# EAGLE design FabScan-Shield_v11 (EAGLE 7.5.0)
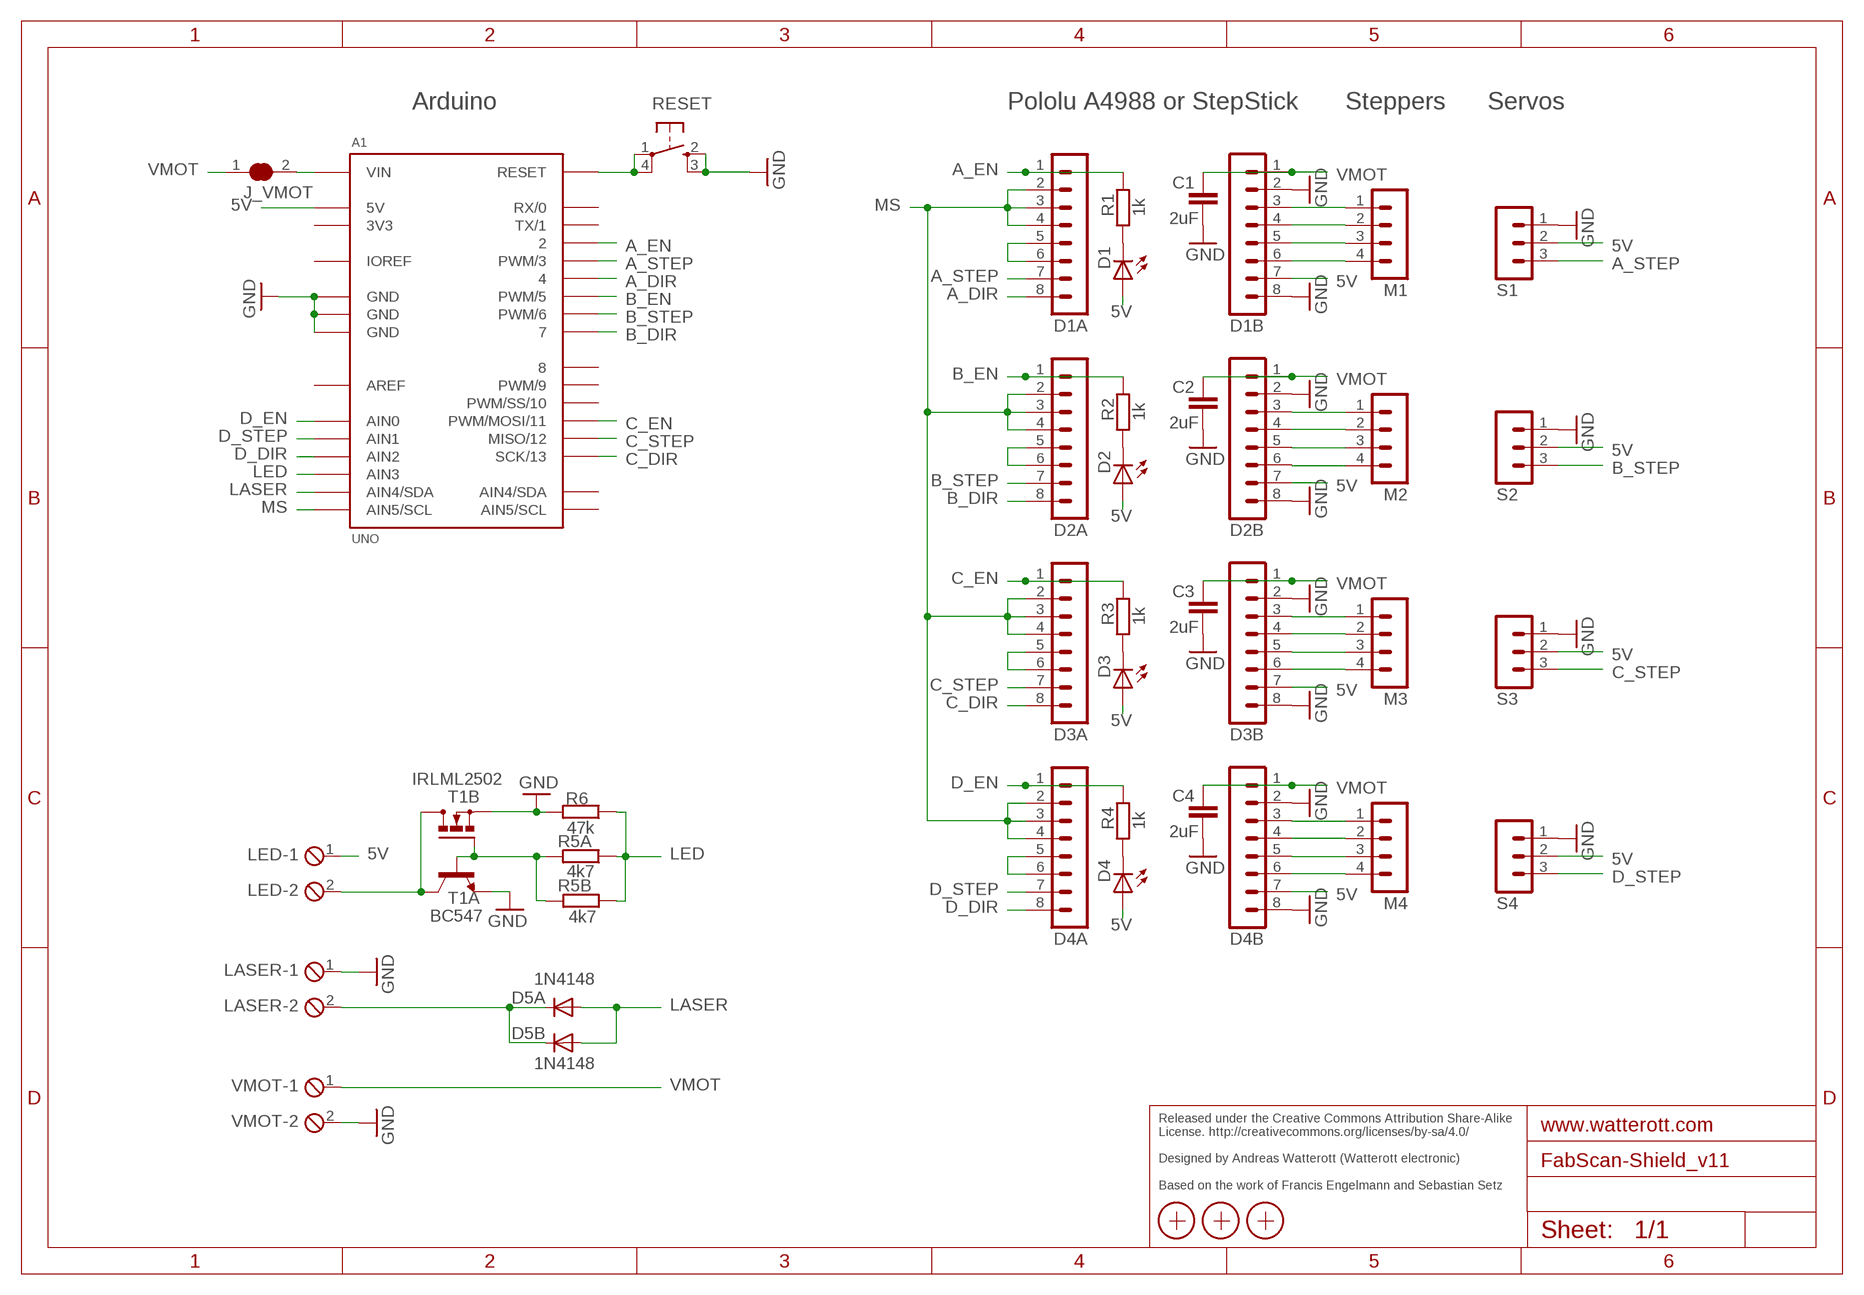
[diagram p0: schematic, sheet 1]

## Parts
A1  UNO  [UNO]
C1  2uF  C-EUC0603  [C0603]
C2  2uF  C-EUC0603  [C0603]
C3  2uF  C-EUC0603  [C0603]
C4  2uF  C-EUC0603  [C0603]
D1  LEDCHIPLED_0603  [CHIPLED_0603]
D1A  MA08-1  [MA08-1]
D1B  MA08-1  [MA08-1]
D2  LEDCHIPLED_0603  [CHIPLED_0603]
D2A  MA08-1  [MA08-1]
D2B  MA08-1  [MA08-1]
D3  LEDCHIPLED_0603  [CHIPLED_0603]
D3A  MA08-1  [MA08-1]
D3B  MA08-1  [MA08-1]
D4  LEDCHIPLED_0603  [CHIPLED_0603]
D4A  MA08-1  [MA08-1]
D4B  MA08-1  [MA08-1]
D5A  1N4148  1N4148DO35-7  [DO35-7]
D5B  1N4148  DIODE-SOD106-R  [SOD106-R]
J_VMOT  SJ  [SJ]
LASER  MPT2  [2POL254]
LED  MPT2  [2POL254]
M1  MA04-1  [MA04-1]
M2  MA04-1  [MA04-1]
M3  MA04-1  [MA04-1]
M4  MA04-1  [MA04-1]
R1  1k  R-EU_R0603  [R0603]
R2  1k  R-EU_R0603  [R0603]
R3  1k  R-EU_R0603  [R0603]
R4  1k  R-EU_R0603  [R0603]
R5A  4k7  R-EU_0204/7  [0204/7]
R5B  4k7  R-EU_R0603  [R0603]
R6  47k  R-EU_R0603  [R0603]
RESET  SW_SMDS  [SW_SMD4]
S1  MA03-1  [MA03-1]
S2  MA03-1  [MA03-1]
S3  MA03-1  [MA03-1]
S4  MA03-1  [MA03-1]
T1A  BC547  [TO92]
T1B  IRLML2502  [MICRO3]
VMOT  MPT2  [2POL254]
X1  PASSER  [PASSER]
X2  PASSER  [PASSER]
X3  PASSER  [PASSER]

## Nets
5V: A1.5V D1.A D1B.7 D2.A D2B.7 D3.A D3B.7 D4.A D4B.7 LED.1 S1.2 S2.2 S3.2 S4.2
A_1A: D1B.5 M1.3
A_1B: D1B.6 M1.4
A_2A: D1B.4 M1.2
A_2B: D1B.3 M1.1
A_DIR: A1.4 D1A.8
A_EN: A1.2 D1A.1 R1.1
A_RST: D1A.5 D1A.6
A_STEP: A1.3(PWM/3) D1A.7 S1.3
B_1A: D2B.5 M2.3
B_1B: D2B.6 M2.4
B_2A: D2B.4 M2.2
B_2B: D2B.3 M2.1
B_DIR: A1.7 D2A.8
B_EN: A1.5(PWM/5) D2A.1 R2.1
B_STEP: A1.6(PWM/6) D2A.7 S2.3
C_1A: D3B.5 M3.3
C_1B: D3B.6 M3.4
C_2A: D3B.4 M3.2
C_2B: D3B.3 M3.1
C_DIR: A1.13(SCK/13) D3A.8
C_EN: A1.11(PWM/MOSI/11) D3A.1 R3.1
C_STEP: A1.12(MISO/12) D3A.7 S3.3
D_1A: D4B.5 M4.3
D_1B: D4B.6 M4.4
D_2A: D4B.4 M4.2
D_2B: D4B.3 M4.1
D_DIR: A1.AIN2 D4A.8
D_EN: A1.AIN0 D4A.1 R4.1
D_STEP: A1.AIN1 D4A.7 S4.3
GND: A1.GND@1(GND) A1.GND@2(GND) A1.GND@3(GND) C1.2 C2.2 C3.2 C4.2 D1B.2 D1B.8 D2B.2 D2B.8 D3B.2 D3B.8 D4B.2 D4B.8 LASER.1 R6.2 RESET.2(S) RESET.3(S1) S1.1 S2.1 S3.1 S4.1 T1A.1(E) T1B.2(S) VMOT.2
LASER: A1.AIN4(AIN4/SDA) D5A.A D5B.A
LED: A1.AIN3 R5A.1 R5B.2 R6.1
MS: A1.AIN5(AIN5/SCL) D1A.2 D1A.3 D1A.4 D2A.2 D2A.3 D2A.4 D3A.2 D3A.3 D3A.4 D4A.2 D4A.3 D4A.4
N$1: D5A.C D5B.C LASER.2
N$2: D1.C R1.2
N$3: D2.C R2.2
N$4: D3.C R3.2
N$5: D4A.5 D4A.6
N$6: LED.2 T1A.3(C) T1B.3(D)
N$7: D4.C R4.2
N$8: R5A.2 R5B.1 T1A.2(B) T1B.1(G)
N$20: D2A.5 D2A.6
N$28: D3A.5 D3A.6
RST: A1.RST(RESET) RESET.1(P) RESET.4(P1)
VIN: A1.VIN J_VMOT.2
VMOT: C1.1 C2.1 C3.1 C4.1 D1B.1 D2B.1 D3B.1 D4B.1 J_VMOT.1 VMOT.1
Unconnected: A1.0(RX/0) A1.1(TX/1) A1.8 A1.9(PWM/9) A1.10(PWM/SS/10) A1.SCL(AIN5/SCL) A1.SDA(AIN4/SDA)

## Notes on the sheet
- Arduino | Pololu A4988 or StepStick | Steppers | Servos
- Released under the Creative Commons Attribution Share-Alike 
  License. http://creativecommons.org/licenses/by-sa/4.0/
  
  Designed by Andreas Watterott (Watterott electronic)
  
  Based on the work of Francis Engelmann and Sebastian Setz

## Power pins joined to a net without a drawn wire
3V3: A1.3V3
AREF: A1.AREF
IOREF: A1.IOREF

## Library data of the parts
A1 = Arduino:UNO
C1-C4 = rcl:C-EU: CAPACITOR, European symbol
D1-D4 = led:LED: LED OSRAM: - CHIPLED LG R971, LG N971, LY N971, LG Q971, LY Q971, LO R971, LY R971 LH N974, LH R974 LS Q976, LO Q976, LY Q976 LO Q996 - Hyper CHIPLED LW Q18S LB Q993, LB Q99A, LB R99A - SideLED LS A670, LO A670, LY A670, LG A670, LP A670 LB A673, LV A673, LT A673, LW A673 LH A674 LY A675 LS A676, LA A676, LO A676, LY A676, LW A676 LS A679, LY A679, LG A679 - Hyper Micro SIDELED® LS Y876, LA Y876, LO Y876, LY Y876 LT Y87S - SmartLED LW L88C, LW L88S LB L89C, LB L89S, LG L890 LS L89K, LO L89K, LY L89K LS L896, LA L896, LO L896, LY L896 - TOPLED LS T670, LO T670, LY T670, LG T670, LP T670 LSG T670, LSP T670, LSY T670, LOP T670, LYG T670 LG T671, LOG T671, LSG T671 LB T673, LV T673, LT T673, LW T673 LH T674 LS T676, LA T676, LO T676, LY T676, LB T676, LH T676, LSB T676, LW T676 LB T67C, LV T67C, LT T67C, LS T67K, LO T67K, LY T67K, LW E67C LS E67B, LA E67B, LO E67B, LY E67B, LB E67C, LV E67C, LT E67C LW T67C LS T679, LY T679, LG T679 LS T770, LO T770, LY T770, LG T770, LP T770 LB T773, LV T773, LT T773, LW T773 LH T774 LS E675, LA E675, LY E675, LS T675 LS T776, LA T776, LO T776, LY T776, LB T776 LHGB T686 LT T68C, LB T68C - Hyper Mini TOPLED® LB M676 - Mini TOPLED Santana® LG M470 LS M47K, LO M47K, LY M47K Source: http://www.osram.convergy.de LUXEON: - LUMILED® LXK2-PW12-R00, LXK2-PW12-S00, LXK2-PW14-U00, LXK2-PW14-V00 LXK2-PM12-R00, LXK2-PM12-S00, LXK2-PM14-U00 LXK2-PE12-Q00, LXK2-PE12-R00, LXK2-PE12-S00, LXK2-PE14-T00, LXK2-PE14-U00 LXK2-PB12-K00, LXK2-PB12-L00, LXK2-PB12-M00, LXK2-PB14-N00, LXK2-PB14-P00, LXK2-PB14-Q00 LXK2-PR12-L00, LXK2-PR12-M00, LXK2-PR14-Q00, LXK2-PR14-R00 LXK2-PD12-Q00, LXK2-PD12-R00, LXK2-PD12-S00 LXK2-PH12-R00, LXK2-PH12-S00 LXK2-PL12-P00, LXK2-PL12-Q00, LXK2-PL12-R00 Source: www.luxeon.com KINGBRIGHT: KA-3528ASYC Source: www.kingbright.com
D1A D1B D2A D2B D3A D3B D4A D4B = con-lstb:MA08-1: PIN HEADER; OC_FARNELL: unknown; OC_NEWARK: unknown
D5A = diode:1N4148: DIODE high speed (Philips)
D5B = diode:DIODE-: DIODE
J_VMOT = jumper:SJ: SMD solder JUMPER
LASER LED VMOT = con-phoenix-254:MPT2: PHOENIX CONNECTOR; OC_FARNELL: unknown; OC_NEWARK: unknown
M1-M4 = con-lstb:MA04-1: PIN HEADER; OC_FARNELL: unknown; OC_NEWARK: unknown
R1-R4 R5A R5B R6 = rcl:R-EU_: RESISTOR, European symbol
RESET = Switch-SMD:SW_SMD
S1-S4 = con-lstb:MA03-1: PIN HEADER; OC_FARNELL: unknown; OC_NEWARK: unknown
T1A = transistor:BC547: NPN TRANSISTOR
T1B = IRF-sot23:IRLML2502: N-Channel Power MOSFET
X1-X3 = SMD:PASSER

## Board
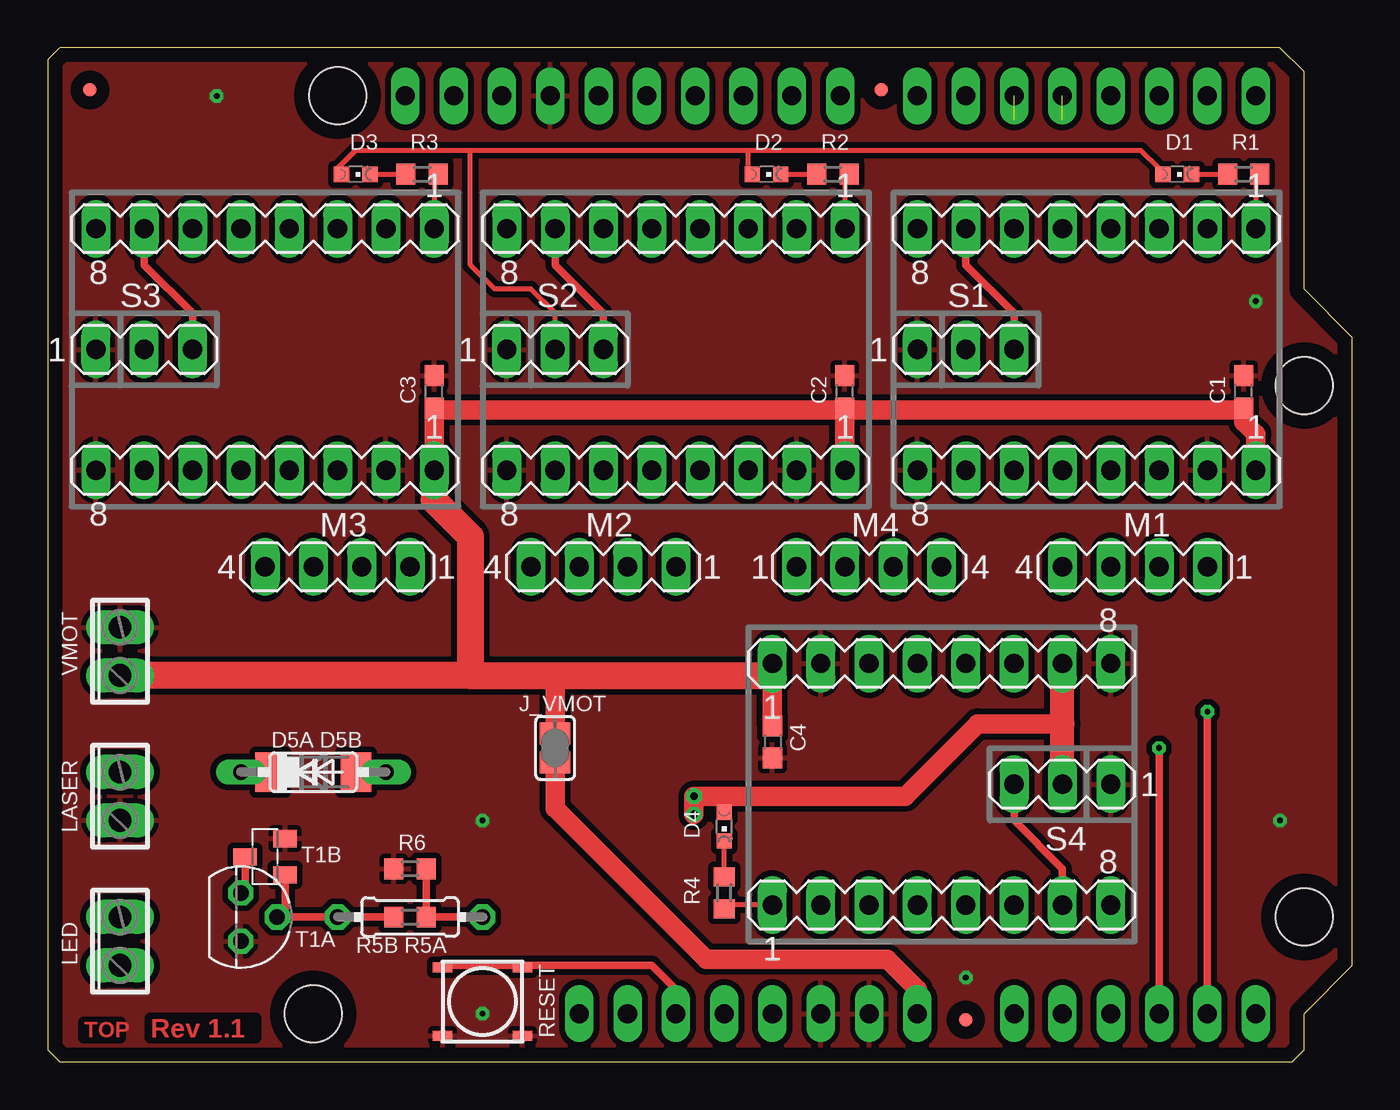
[diagram p1: board, top side]
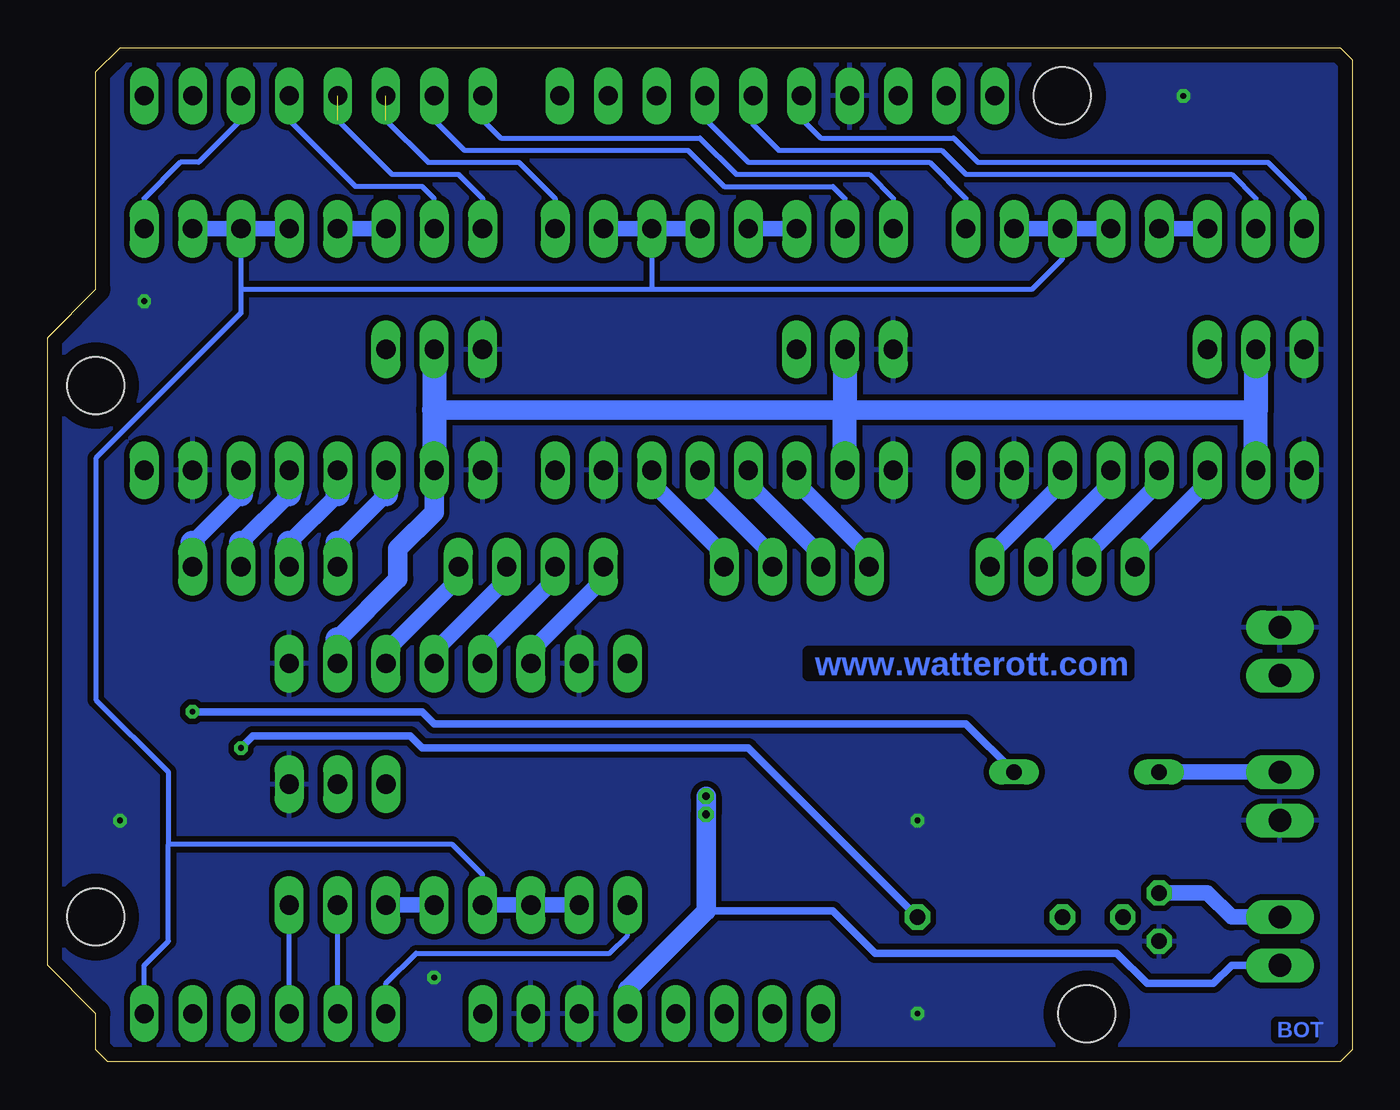
[diagram p2: board, bottom side, seen from below]

Size 68.58 x 53.34 mm. Coordinates in mm from the lower left corner, seen from the top.
Copper layers (1*16): Top 0.035mm / dielectric 1.5mm / Bottom 0.035mm
Design rules "default *": minimum track width 8mil, minimum drill 0.3mm, track to track 8mil, track to pad 8mil, pad to pad 8mil, via to via 8mil, smd to smd 8mil, copper to edge 30mil, drill to drill 8mil, minimum pad ring 10mil, minimum via ring 8mil, stop-mask expansion 4mil, vias tented up to drill 0.5mm, thermal gap 10mil

### Footprints (pad centres in the part's own frame; a part is rotated, then mirrored left to right if it is on the bottom)
UNO = drill 1 long: 0 63.5,50.8; 1 60.96,50.8; 2 58.42,50.8; 3 55.88,50.8; 3V3 35.56,2.54; 4 53.34,50.8; 5 50.8,50.8; 5V 38.1,2.54; 6 48.26,50.8; 7 45.72,50.8; 8 41.656,50.8; 9 39.116,50.8; 10 36.576,50.8; 11 34.036,50.8; 12 31.496,50.8; 13 28.956,50.8; AIN0 50.8,2.54; AIN1 53.34,2.54; AIN2 55.88,2.54; AIN3 58.42,2.54; AIN4 60.96,2.54; AIN5 63.5,2.54; AREF 23.876,50.8; GND@1 40.64,2.54; GND@2 43.18,2.54; GND@3 26.416,50.8; IOREF 30.48,2.54; NC 27.94,2.54; RST 33.02,2.54; SCL 18.796,50.8; SDA 21.336,50.8; VIN 45.72,2.54 | hole 3: 66.04,35.56; 66.04,7.62; 15.24,50.8; 13.97,2.54
C0603 = smd 1.1 x 1: 1 -0.85,0; 2 0.85,0
CHIPLED_0603 = smd 0.8 x 0.8: A 0,-0.75; C 0,0.75
MA08-1 = drill 1.016 long: 1 -8.89,0; 2 -6.35,0; 3 -3.81,0; 4 -1.27,0; 5 1.27,0; 6 3.81,0; 7 6.35,0; 8 8.89,0
DO35-7 = drill 0.813 long: A 3.81,0; C -3.81,0
SOD106-R = smd 1.6 x 2.1: A 2.25,0; C -2.25,0
SJ = smd 1.168 x 1.6: 1 -0.762,0; 2 0.762,0
2POL254 = drill 1.2 long: 1 -1.27,0; 2 1.27,0
MA04-1 = drill 1.016 long: 1 -3.81,0; 2 -1.27,0; 3 1.27,0; 4 3.81,0
R0603 = smd 1 x 1.1: 1 -0.85,0; 2 0.85,0
0204/7 = drill 0.813 octagon: 1 -3.81,0; 2 3.81,0
SW_SMD4 = smd 0.508 x 1.016: 1 -1.8,-2.1; 2 1.8,-2.1; 3 1.8,2.1; 4 -1.8,2.1
MA03-1 = drill 1.016 long: 1 -2.54,0; 2 0,0; 3 2.54,0
TO92 = drill 0.813 octagon: 1 1.27,0; 2 0,1.905; 3 -1.27,0
MICRO3 = smd 0.9 x 1.25: 1 -0.95,-1.05; 2 0.95,-1.05; 3 0,1.05
PASSER = smd 0.7 x 0.7: X 0,0

### Placement (x,y rotation side)
A1  0,0 0 top
C1  62.87,35.24 90 top
C2  41.91,35.24 90 top
C3  20.32,35.24 90 top
C4  38.1,16.83 270 top
D1  59.37,46.67 270 top
D1A  54.61,43.81 180 top
D1B  54.61,31.11 180 top
D2  37.78,46.67 270 top
D2A  33.02,43.81 180 top
D2B  33.02,31.11 180 top
D3  16.19,46.67 270 top
D3A  11.43,43.81 180 top
D3B  11.43,31.11 180 top
D4  35.56,12.38 180 top
D4A  46.99,8.26 0 top
D4B  46.99,20.95 0 top
D5A  13.97,15.24 0 top
D5B  13.97,15.24 0 top
J_VMOT  26.67,16.51 270 top
LASER  3.81,13.97 90 top
LED  3.81,6.35 90 top
M1  57.15,26.04 180 top
M2  29.21,26.04 180 top
M3  15.24,26.04 180 top
M4  43.18,26.04 0 top
R1  62.87,46.67 180 top
R2  41.27,46.67 180 top
R3  19.68,46.67 180 top
R4  35.56,8.89 90 top
R5A  19.05,7.62 180 top
R5B  19.05,7.62 0 top
R6  19.05,10.16 180 top
RESET  22.86,3.17 270 top
S1  48.26,37.47 0 top
S2  26.67,37.47 0 top
S3  5.08,37.47 0 top
S4  53.34,14.61 180 top
T1A  10.16,7.62 270 top
T1B  11.43,10.79 90 top
VMOT  3.81,21.59 90 top
X1  2.22,51.12 0 top
X2  48.26,2.22 0 top
X3  43.81,51.12 0 top

### Tracks (layer width: path | path; a pad name or v marks a point on that pad's centre or on a via)
5V  (via drill 0.4)
  Top 0.254: D3.A 15.24,46.67 15.24,46.99 16.19,47.94 22.23,47.94 | 22.23,47.94 36.83,47.94 | 36.83,47.94 57.47,47.94 58.42,46.99 58.42,46.88 D1.A | D2.A 36.83,46.67 36.83,47.94 | S2.2 26.67,39.37 25.4,40.64 23.5,40.64 22.23,41.91 22.23,47.94 | D4.A 35.56,13.65 35.88,13.97
  Top 1.016: 53.34,17.78 48.9,17.78 45.09,13.97 35.88,13.97 v33.97,13.97 v33.97,13.02
  Top 1.27: S4.2 53.34,17.78 D4B.7
  Bottom 0.406: LED.1 6.35,5.08 7.3,4.13 10.79,4.13 12.38,5.71 25.08,5.71 27.3,7.94 33.97,7.94
  Bottom 1.016: 5.08,34.29 26.67,34.29 48.26,34.29 | A1.5V 38.1,3.81 33.97,7.94 v33.97,13.02 v33.97,13.97 | 53.34,22.23 50.16,25.4 50.16,26.99 48.26,28.89 D1B.7
  Bottom 1.27: D3B.7 5.08,34.29 S3.2 | D1B.7 48.26,34.29 S1.2 | D2B.7 26.67,34.29 S2.2 | D4B.7 53.34,22.23
A_1A
  Bottom 0.813: 53.34,29.84 55.88,27.3
  Bottom 1.27: D1B.5 53.34,29.84 | 55.88,27.3 M1.3
A_1B
  Bottom 0.813: 50.8,29.84 53.34,27.3
  Bottom 1.27: D1B.6 50.8,29.84 | 53.34,27.3 M1.4
A_2A
  Bottom 0.813: 55.88,29.84 58.42,27.3
  Bottom 1.27: D1B.4 55.88,29.84 | 58.42,27.3 M1.2
A_2B
  Bottom 0.813: 58.42,29.84 60.96,27.3
  Bottom 1.27: D1B.3 58.42,29.84 | 60.96,27.3 M1.1
A_DIR  (1 unrouted)
  Bottom 0.254: D1A.8 45.72,45.4 46.99,46.67 50.48,46.67 53.34,49.53
A_EN
  Top 0.254: R1.1 63.5,46.67 D1A.1
  Bottom 0.254: A1.2 58.42,49.53 60.64,47.31 61.59,47.31 63.5,45.4 D1A.1
A_RST
  Bottom 0.813: D1A.6 D1A.5
A_STEP
  Top 0.406: D1A.7 48.26,41.91 50.8,39.37 S1.3
  Bottom 0.254: A1.3 55.88,49.53 52.39,46.04 48.9,46.04 48.26,45.4 D1A.7
B_1A
  Bottom 0.813: 31.75,30.48 27.94,26.67
  Bottom 1.27: D2B.5 31.75,30.48 | 27.94,26.67 M2.3
B_1B
  Bottom 0.813: 29.21,30.48 25.4,26.67
  Bottom 1.27: D2B.6 29.21,30.48 | 25.4,26.67 M2.4
B_2A
  Bottom 0.813: 34.29,30.48 30.48,26.67
  Bottom 1.27: D2B.4 34.29,30.48 | 30.48,26.67 M2.2
B_2B
  Bottom 0.813: 36.83,30.48 33.02,26.67
  Bottom 1.27: D2B.3 36.83,30.48 | 33.02,26.67 M2.1
B_DIR
  Bottom 0.254: A1.7 45.72,49.53 44.77,48.58 34.29,48.58 32.38,46.67 25.4,46.67 24.13,45.4 D2A.8
B_EN  (1 unrouted)
  Top 0.254: R2.1 41.91,46.67 D2A.1
  Bottom 0.254: D2A.1 41.91,45.4 43.81,47.31 48.58,47.31 50.8,49.53
B_STEP
  Top 0.406: D2A.7 26.67,41.91 29.21,39.37 S2.3
  Bottom 0.254: A1.6 48.26,49.53 46.67,47.94 34.92,47.94 33.02,46.04 27.3,46.04 26.67,45.4 D2A.7
C_1A
  Bottom 0.813: 10.16,30.48 13.97,26.67
  Bottom 1.27: D3B.5 10.16,30.48 | 13.97,26.67 M3.3
C_1B
  Bottom 0.813: 7.62,30.48 11.43,26.67
  Bottom 1.27: D3B.6 7.62,30.48 | 11.43,26.67 M3.4
C_2A
  Bottom 0.813: 12.7,30.48 16.51,26.67
  Bottom 1.27: D3B.4 12.7,30.48 | 16.51,26.67 M3.2
C_2B
  Bottom 0.813: 15.24,30.48 19.05,26.67
  Bottom 1.27: D3B.3 15.24,30.48 | 19.05,26.67 M3.1
C_DIR
  Bottom 0.254: A1.13 28.96,49.59 27.94,48.58 20.95,48.58 19.68,47.31 4.45,47.31 2.54,45.4 D3A.8
C_EN
  Top 0.254: R3.1 20.32,46.67 D3A.1
  Bottom 0.254: A1.11 34.04,49.59 31.75,47.31 22.23,47.31 20.32,45.4 D3A.1
C_STEP
  Top 0.406: D3A.7 5.08,41.91 7.62,39.37 S3.3
  Bottom 0.254: A1.12 31.5,49.28 30.16,47.94 21.59,47.94 20.32,46.67 6.35,46.67 5.08,45.4 D3A.7
D_1A
  Bottom 0.813: 48.26,21.59 44.45,25.4
  Bottom 1.27: D4B.5 48.26,21.59 | 44.45,25.4 M4.3
D_1B
  Bottom 0.813: 50.8,21.59 46.99,25.4
  Bottom 1.27: D4B.6 50.8,21.59 | 46.99,25.4 M4.4
D_2A
  Bottom 0.813: 45.72,21.59 41.91,25.4
  Bottom 1.27: D4B.4 45.72,21.59 | 41.91,25.4 M4.2
D_2B
  Bottom 0.813: 43.18,21.59 39.37,25.4
  Bottom 1.27: D4B.3 43.18,21.59 | 39.37,25.4 M4.1
D_DIR
  Bottom 0.254: A1.AIN2 D4A.8
D_EN
  Top 0.254: D4A.1 35.77,8.26 R4.1
  Bottom 0.254: A1.AIN0 50.8,4.13 49.21,5.71 39.05,5.71 38.1,6.67 D4A.1
D_STEP
  Top 0.406: D4A.7 53.34,10.16 50.8,12.7 S4.3
  Bottom 0.254: A1.AIN1 D4A.7
GND  (via drill 0.3)
  other vias: 64.77,12.7 63.5,40.01 22.86,2.54 22.86,12.7 8.89,50.8 48.26,4.45
  pour Bottom (isolate 0.305): 0,53.34 68.58,53.34 68.58,0 0,0
  pour Top (isolate 0.305): 0,0 0,53.34 68.58,53.34 68.58,0
LASER  (via drill 0.3)
  Top 0.254: D5B.A D5A.A
  Top 0.406: v60.96,18.41 A1.AIN4
  Bottom 0.406: v60.96,18.41 48.9,18.41 48.26,17.78 20.32,17.78 D5A.A
LED  (via drill 0.3)
  Top 0.406: R5A.1 R5B.2 R6.1 | A1.AIN3 v58.42,16.51
  Bottom 0.406: v58.42,16.51 57.78,17.14 49.53,17.14 48.9,16.51 31.75,16.51 R5A.1
MS
  Bottom 0.254: D1A.3 58.42,40.64 | 58.42,40.64 36.83,40.64 | D2A.3 36.83,40.64 | 36.83,40.64 16.83,40.64 15.24,42.23 D3A.3 | D4A.4 45.72,9.84 47.31,11.43 62.23,11.43 | A1.AIN5 63.5,5.08 62.23,6.35 62.23,11.43 | 58.42,40.64 58.42,39.37 66.04,31.75 66.04,19.05 62.23,15.24 62.23,11.43
  Bottom 0.813: D3A.4 D3A.3 D3A.2 | D2A.2 D2A.3 D2A.4 | D1A.4 D1A.3 D1A.2 | D4A.4 D4A.3 D4A.2
N$1
  Top 0.254: D5A.C D5B.C
  Bottom 0.813: LASER.2 D5A.C
N$2
  Top 0.254: D1.C R1.2
N$3
  Top 0.254: D2.C R2.2
N$4
  Top 0.254: D3.C R3.2
N$5
  Bottom 0.813: D4A.6 D4A.5
N$6
  Top 0.406: T1B.3 10.38,9.11 T1A.3
  Bottom 0.813: LED.2 6.35,7.62 7.62,8.89 T1A.3
N$7
  Top 0.254: R4.2 D4.C
N$8
  Top 0.406: T1B.1 12.48,8.04 T1A.2 R5A.2 R5B.1
N$13
  Top 0.61: 26.67,17.14 26.67,15.88
N$20
  Bottom 0.813: D2A.6 D2A.5
N$28
  Bottom 0.813: D3A.6 D3A.5
RST
  Top 0.406: A1.RST 33.02,3.81 31.75,5.08 25.08,5.08 | 25.08,5.08 25.07,5.08 | 25.07,5.08 RESET.4 24.98,4.97 25.08,5.08 | 25.07,5.08 20.86,5.08 RESET.1
VIN
  Top 1.016: A1.VIN 45.72,3.81 44.13,5.4 34.61,5.4 26.67,13.34 J_VMOT.2
VMOT
  Top 1.016: C4.1 38.1,20.32 D4B.1 | J_VMOT.1 26.67,20.32 | D3B.1 C3.1 20.42,34.29 41.91,34.29 | 41.91,34.29 C2.1 42.01,34.29 62.87,34.29 | D1B.1 63.5,33.02 62.87,33.66 62.87,34.29 | C1.1 62.87,34.29 | D2B.1 41.91,34.29
  Top 1.422: D3B.1 20.32,29.53 22.23,27.62 22.23,20.32 | 22.23,20.32 26.67,20.32 38.1,20.32 | 22.23,20.32 VMOT.1

### Text on the board
Top: TOP | Rev 1.1
Bottom: www.watterott.com | BOT
Reference: Silkscreen: 51 tDocu
tDocu: open | hardware | Dir | En | Dir | En | Dir | En | 3 | 2 | 1 | - | + | S | - | + | S | - | + | S | GND | VMot | GND | VMot | GND | VMot | GND | 1B 1A 2A 2B | 1B 1A 2A 2B | 2B 2A 1A 1B | 1B 1A 2A 2B | VMot | Power | VMot | GND | S | + | - | 4 | VMot-Vin | FabScan-Shield | GND | Laser | En | Dir | Reset | LED | 5V